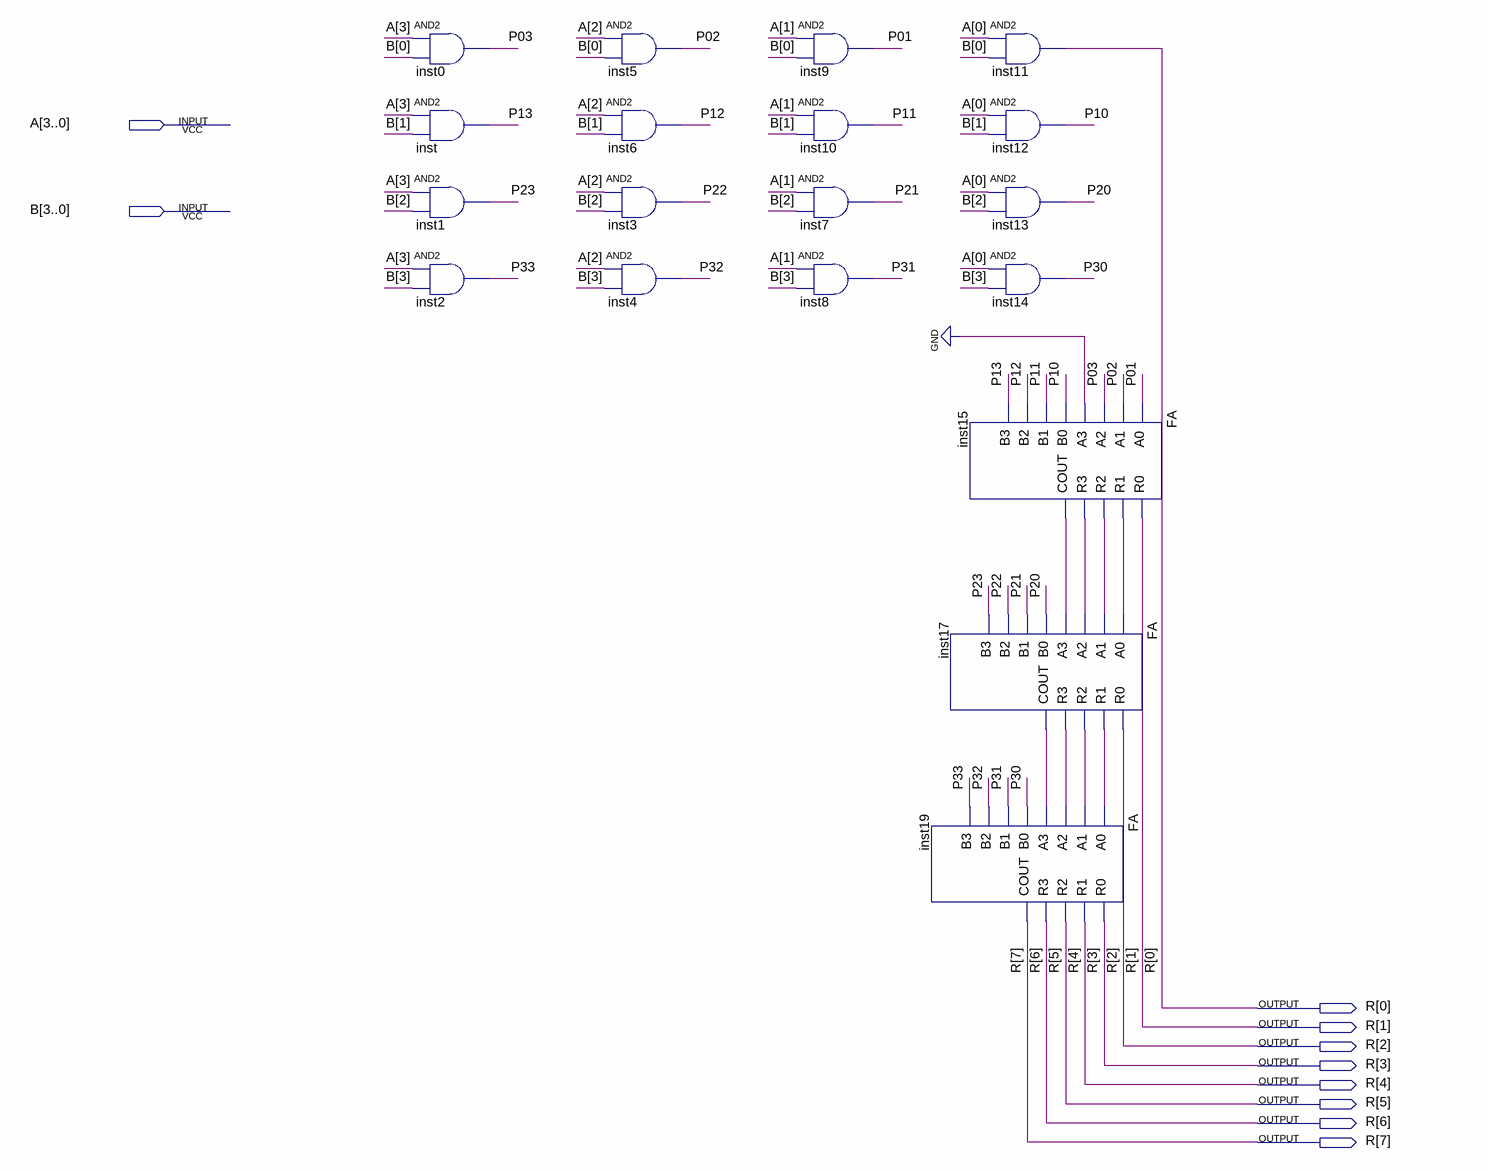
[diagram p0: schematic sheet]
// Quartus schematic multiplier - Copy.bdf as structural Verilog: 19 symbols, 10 pins
module \multiplier_-_Copy  (
  input  [3:0] A,
  input  [3:0] B,
  output [7:0] R
);

  wire inst15_cout, inst15_r1, inst15_r2, inst15_r3, inst17_cout, inst17_r1, inst17_r2, inst17_r3, P01, P02,
       P03, P10, P11, P12, P13, P20, P21, P22, P23, P30, P31, P32, P33;

  and inst0 (P03, A[3], B[0]);
  and inst (P13, A[3], B[1]);
  and inst1 (P23, A[3], B[2]);
  and inst2 (P33, A[3], B[3]);
  and inst5 (P02, A[2], B[0]);
  and inst6 (P12, A[2], B[1]);
  and inst3 (P22, A[2], B[2]);
  and inst4 (P32, A[2], B[3]);
  and inst9 (P01, A[1], B[0]);
  and inst10 (P11, A[1], B[1]);
  and inst7 (P21, A[1], B[2]);
  and inst8 (P31, A[1], B[3]);
  FA inst17 (
    .A0(inst15_r1), .A1(inst15_r2), .A2(inst15_r3), .A3(inst15_cout), .B0(P20), .B1(P21), .B2(P22), .B3(P23),
    .R0(R[2]), .R1(inst17_r1), .R2(inst17_r2), .R3(inst17_r3), .COUT(inst17_cout));
  FA inst19 (
    .A0(inst17_r1), .A1(inst17_r2), .A2(inst17_r3), .A3(inst17_cout), .B0(P30), .B1(P31), .B2(P32), .B3(P33),
    .R0(R[3]), .R1(R[4]), .R2(R[5]), .R3(R[6]), .COUT(R[7]));
  and inst11 (R[0], A[0], B[0]);
  and inst12 (P10, A[0], B[1]);
  and inst13 (P20, A[0], B[2]);
  and inst14 (P30, A[0], B[3]);
  FA inst15 (
    .A0(P01), .A1(P02), .A2(P03), .A3(1'b0), .B0(P10), .B1(P11), .B2(P12), .B3(P13), .R0(R[1]),
    .R1(inst15_r1), .R2(inst15_r2), .R3(inst15_r3), .COUT(inst15_cout));
endmodule
